# EAGLE design RTI-Dome-Shutter-ESP32 (EAGLE 9.7.0)
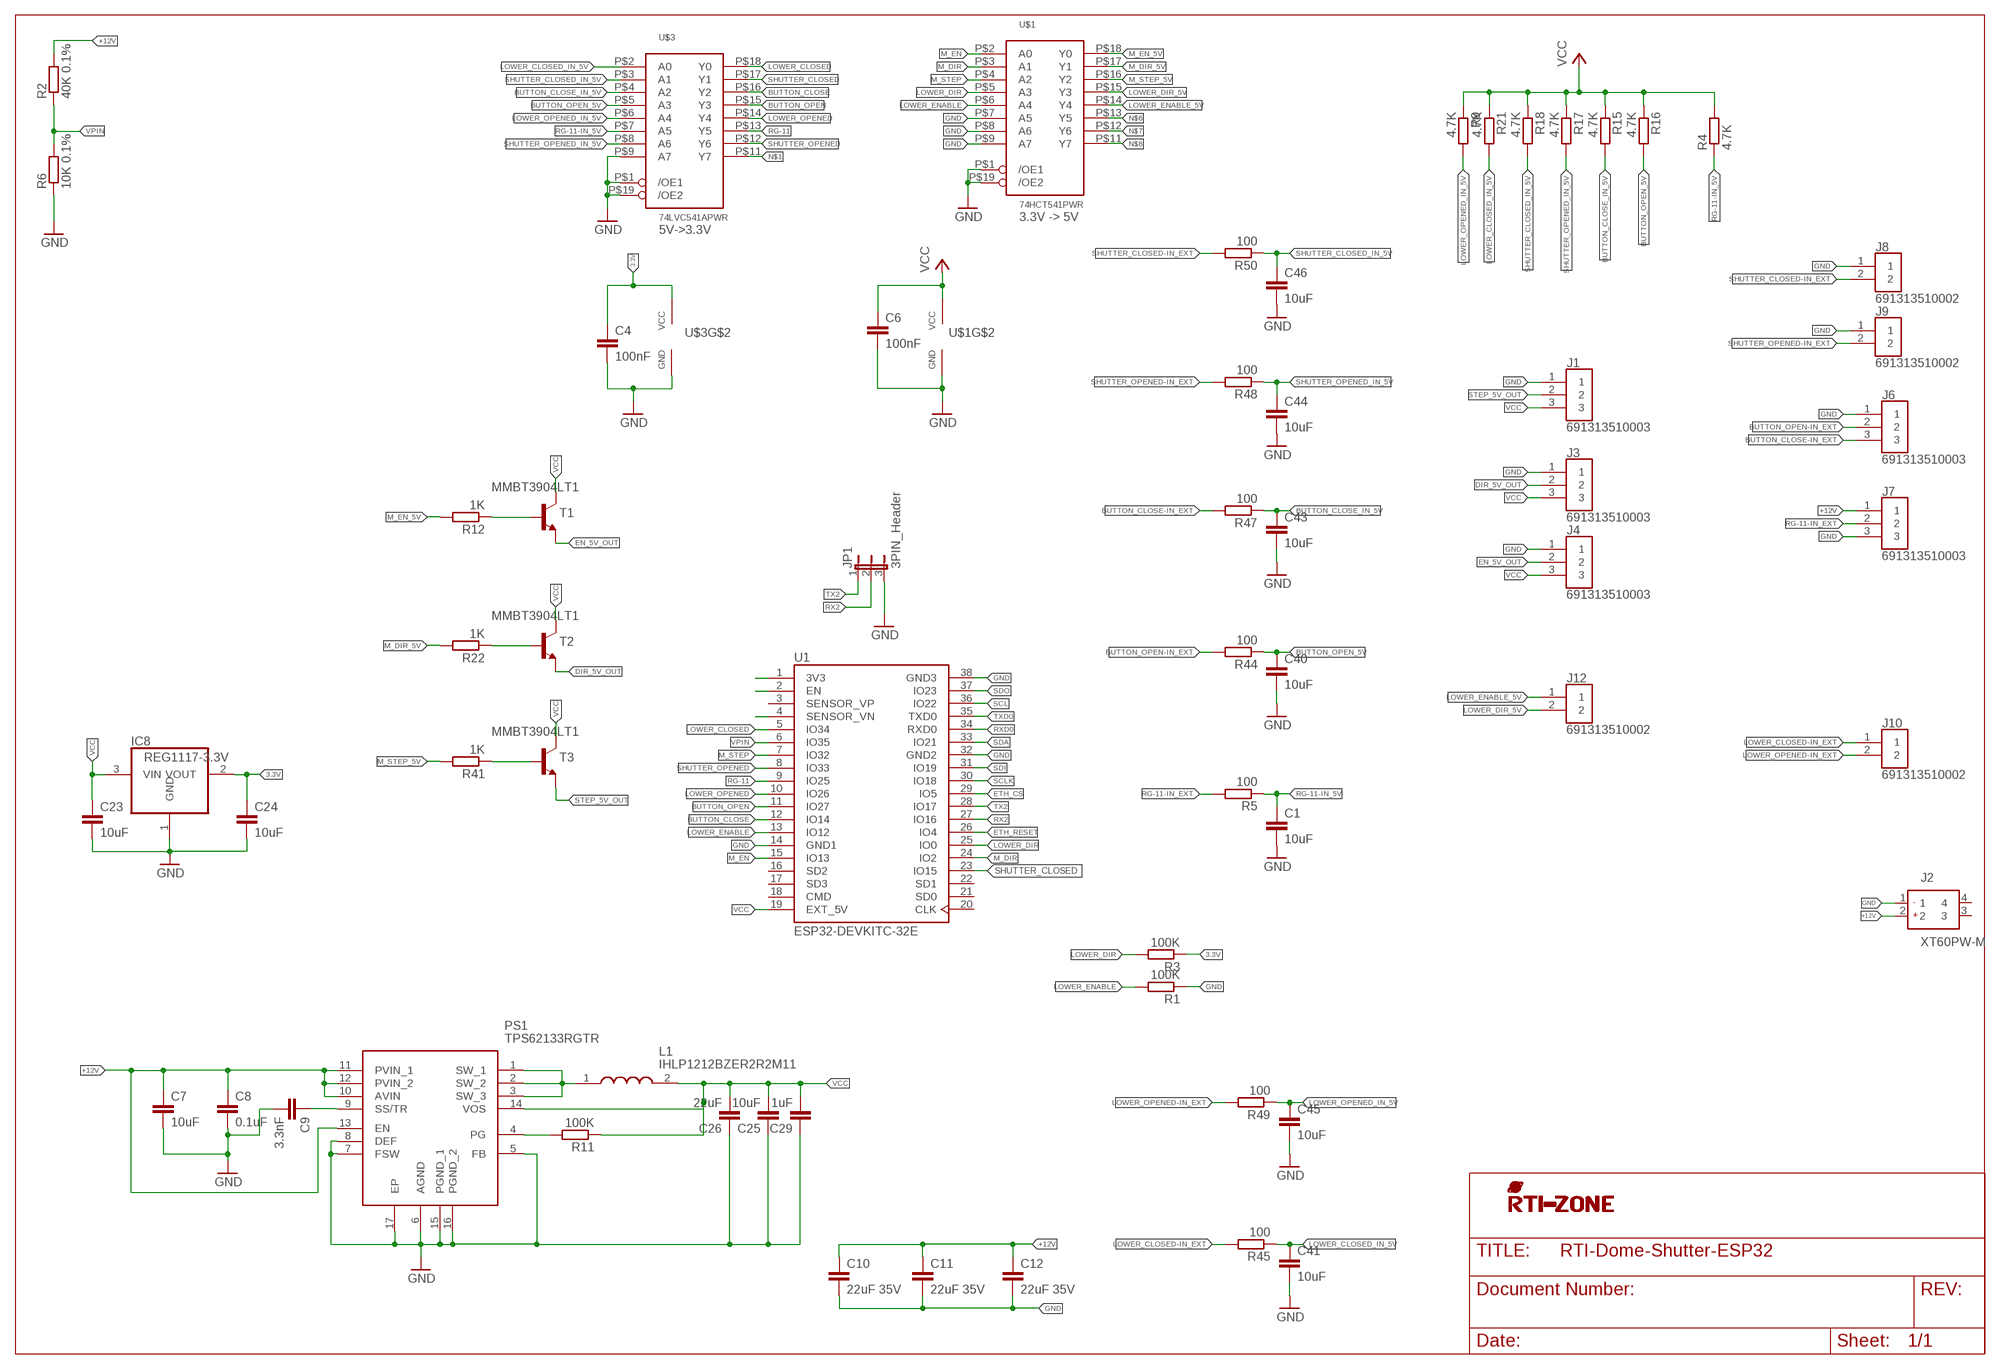
[diagram p0: schematic, sheet 1]

## Parts
C1  10uF  C-EU'0603'  [C0603]
C4  100nF  C-EU'0603'  [C0603]
C6  100nF  C-EU'0603'  [C0603]
C7  10uF  C-EUC1206  [C1206]
C8  0.1uF  C-EUC1206  [C1206]
C9  3.3nF  C-EUC0805  [C0805]
C10  22uF 35V  C-EUC1206  [C1206]
C11  22uF 35V  C-EUC1206  [C1206]
C12  22uF 35V  C-EUC1206  [C1206]
C23  10uF  C-EU'0603'  [C0603]
C24  10uF  C-EU'0603'  [C0603]
C25  10uF  C-EUC0805  [C0805]
C26  22uF  C-EUC0805  [C0805]
C29  1uF  C-EUC0805  [C0805]
C40  10uF  C-EU'0603'  [C0603]
C41  10uF  C-EU'0603'  [C0603]
C43  10uF  C-EU'0603'  [C0603]
C44  10uF  C-EU'0603'  [C0603]
C45  10uF  C-EU'0603'  [C0603]
C46  10uF  C-EU'0603'  [C0603]
IC8  REG1117-3.3V  REG1117  [SOT223]
J1  691313510003  [691313510003]
J2  XT60PW-M  [XT60PWM]
J3  691313510003  [691313510003]
J4  691313510003  [691313510003]
J6  691313510003  [691313510003]
J7  691313510003  [691313510003]
J8  691313510002  [SHDRRA2W100P0X508_1X2_1216X120]
J9  691313510002  [SHDRRA2W100P0X508_1X2_1216X120]
J10  691313510002  [SHDRRA2W100P0X508_1X2_1216X120]
J12  691313510002  [SHDRRA2W100P0X508_1X2_1216X120]
JP1  3PIN_Header  JP2E  [JP2]
L1  IHLP1212BZER2R2M11  [INDPM3630X200N]
PS1  TPS62133RGTR  [QFN50P300X300X100-17N]
R1  100K  R-EU'0603'  [R0603]
R2  40K 0.1%  R-EU'0603'  [R0603]
R3  100K  R-EU'0603'  [R0603]
R4  4.7K  R-EU'0603'  [R0603]
R5  100  R-EU'0603'  [R0603]
R6  10K 0.1%  R-EU'0603'  [R0603]
R9  4.7K  R-EU'0603'  [R0603]
R11  100K  R-EU_R0603  [R0603]
R12  1K  R-EU'0603'  [R0603]
R15  4.7K  R-EU'0603'  [R0603]
R16  4.7K  R-EU'0603'  [R0603]
R17  4.7K  R-EU'0603'  [R0603]
R18  4.7K  R-EU'0603'  [R0603]
R21  4.7K  R-EU'0603'  [R0603]
R22  1K  R-EU'0603'  [R0603]
R41  1K  R-EU'0603'  [R0603]
R44  100  R-EU'0603'  [R0603]
R45  100  R-EU'0603'  [R0603]
R47  100  R-EU'0603'  [R0603]
R48  100  R-EU'0603'  [R0603]
R49  100  R-EU'0603'  [R0603]
R50  100  R-EU'0603'  [R0603]
T1  MMBT3904LT1  MMBT3904LT1-NPN-SOT23-BEC  [SOT23-BEC]
T2  MMBT3904LT1  MMBT3904LT1-NPN-SOT23-BEC  [SOT23-BEC]
T3  MMBT3904LT1  MMBT3904LT1-NPN-SOT23-BEC  [SOT23-BEC]
U1  ESP32-DEVKITC-32E  ESP32-DEVKITC-32D  [MODULE_ESP32-DEVKITC-32D]
U$1  74HCT541PWR  74541B  [TSSOP20]
U$3  74LVC541APWR  74541B  [TSSOP20]
U$4  RTI-LOGO_BIG  [LOGO_BIG]

## Nets
3.3V: C4.1 C24.1 IC8.2(VOUT) R3.1 U$3.P$20(VCC)
+12V [+12V]: C7.1 C8.1 C10.1 C11.1 C12.1 J2.2 J7.1 PS1.10(AVIN) PS1.11(PVIN_1) PS1.12(PVIN_2) PS1.13(EN) R2.2
BUTTON_CLOSE: U1.12(IO14) U$3.P$16(Y2)
BUTTON_CLOSE-IN_EXT: J6.3 R47.2
BUTTON_CLOSE_IN_5V: C43.1 R15.2 R47.1 U$3.P$4(A2)
BUTTON_OPEN: U1.11(IO27) U$3.P$15(Y3)
BUTTON_OPEN-IN_EXT: J6.2 R44.2
BUTTON_OPEN_5V: C40.1 R16.2 R44.1 U$3.P$5(A3)
DIR-5V_TR: R22.1 T2.B
DIR_5V_OUT: J3.2 T2.E
EN-5V_TR: R12.1 T1.B
EN_5V_OUT: J4.2 T1.E
ETH_CS: U1.29(IO5)
ETH_RESET: U1.26(IO4)
GND [GND]: C1.2 C4.2 C6.2 C7.2 C8.2 C9.2 C10.2 C11.2 C12.2 C23.2 C24.2 C25.1 C26.1 C29.1 C40.2 C41.2 C43.2 C44.2 C45.2 C46.2 IC8.1(GND) J1.1 J2.1 J3.1 J4.1 J6.1 J7.3 J8.1 J9.1 JP1.3 PS1.5(FB) PS1.6(AGND) PS1.7(FSW) PS1.8(DEF) PS1.15(PGND_1) PS1.16(PGND_2) PS1.17(EP) R1.1 R6.1 U1.14(GND1) U1.32(GND2) U1.38(GND3) U$1.P$1(/OE1) U$1.P$7(A5) U$1.P$8(A6) U$1.P$9(A7) U$1.P$10(GND) U$1.P$19(/OE2) U$3.P$1(/OE1) U$3.P$9(A7) U$3.P$10(GND) U$3.P$19(/OE2)
LOWER_CLOSED: U1.5(IO34) U$3.P$18(Y0)
LOWER_CLOSED-IN_EXT: J10.1 R45.2
LOWER_CLOSED_IN_5V: C41.1 R21.2 R45.1 U$3.P$2(A0)
LOWER_DIR: R3.2 U1.25(IO0) U$1.P$5(A3)
LOWER_DIR_5V: J12.2 U$1.P$15(Y3)
LOWER_ENABLE: R1.2 U1.13(IO12) U$1.P$6(A4)
LOWER_ENABLE_5V: J12.1 U$1.P$14(Y4)
LOWER_OPENED: U1.10(IO26) U$3.P$14(Y4)
LOWER_OPENED-IN_EXT [GND]: J10.2 R49.2
LOWER_OPENED_IN_5V [GND]: C45.1 R9.2 R49.1 U$3.P$6(A4)
M_DIR: U1.24(IO2) U$1.P$3(A1)
M_DIR_5V: R22.2 U$1.P$17(Y1)
M_EN: U1.15(IO13) U$1.P$2(A0)
M_EN_5V: R12.2 U$1.P$18(Y0)
M_STEP: U1.7(IO32) U$1.P$4(A2)
M_STEP_5V: R41.2 U$1.P$16(Y2)
N$1: U$3.P$11(Y7)
N$6: U$1.P$13(Y5)
N$7: U$1.P$12(Y6)
N$8: U$1.P$11(Y7)
N$9: U1.1(3V3)
N$10: U1.2(EN)
N$11: U1.4(SENSOR_VN)
PG: PS1.4(PG) R11.2
RG-11: U1.9(IO25) U$3.P$13(Y5)
RG-11-IN_5V: C1.1 R4.1 R5.1 U$3.P$7(A5)
RG-11-IN_EXT: J7.2 R5.2
RX2: JP1.2 U1.27(IO16)
RXD0: U1.34(RXD0)
SCL: U1.36(IO22)
SCLK: U1.30(IO18)
SDA: U1.33(IO21)
SDI: U1.31(IO19)
SDO: U1.37(IO23)
SHUTTER_CLOSED: U1.23(IO15) U$3.P$17(Y1)
SHUTTER_CLOSED-IN_EXT: J8.2 R50.2
SHUTTER_CLOSED_IN_5V: C46.1 R18.2 R50.1 U$3.P$3(A1)
SHUTTER_OPENED: U1.8(IO33) U$3.P$12(Y6)
SHUTTER_OPENED-IN_EXT: J9.2 R48.2
SHUTTER_OPENED_IN_5V: C44.1 R17.2 R48.1 U$3.P$8(A6)
SS/TR: C9.1 PS1.9(SS/TR)
STEP-5V_TR: R41.1 T3.B
STEP_5V_OUT: J1.2 T3.E
SW: L1.1 PS1.1(SW_1) PS1.2(SW_2) PS1.3(SW_3)
TX2: JP1.1 U1.28(IO17)
TXD0: U1.35(TXD0)
VCC: C6.1 C23.1 C25.2 C26.2 C29.2 IC8.3(VIN) J1.3 J3.3 J4.3 L1.2 PS1.14(VOS) R4.2 R9.1 R11.1 R15.1 R16.1 R17.1 R18.1 R21.1 T1.C T2.C T3.C U1.19(EXT_5V) U$1.P$20(VCC)
VPIN: R2.1 R6.2 U1.6(IO35)
Unconnected: J2.3 J2.4 U1.3(SENSOR_VP) U1.16(SD2) U1.17(SD3) U1.18(CMD) U1.20(CLK) U1.21(SD0) U1.22(SD1)

## Notes on the sheet
- 3.3V -> 5V
- 5V->3.3V

## Library data of the parts
C1 C23 C24 C40 C41 C43-C46 = rti:C-EU; MPN: CC0805KKX5R8BB106
C4 C6 = rti:C-EU; MPN: 0805YD104KAT2A
C7-C12 C25 C26 C29 = rcl:C-EU: CAPACITOR, European symbol; SPICEPREFIX: C
IC8 = burr-brown:REG1117: 800mA and 1A Low Dropout (LDO) Positive Regulator 1.8V, 2.5V, 2.85V, 3.3V, 5V, and Adj; MPN: REG1117-3.3/2K5; OC_FARNELL: 1097566; OC_NEWARK: 14P6981
J1 J3 J4 J6 J7 = samacsys:691313510003: Wurth Elektronik 313 Series 5.08mm Pitch Straight Pluggable Terminal Block, PCB Header, Through Hole, 3 Way Source: Datasheet <https://katalog.we-online.de/em/datasheet/6913135100xx.pdf>; DESCRIPTION: Wurth Elektronik 313 Series 5.08mm Pitch Straight Pluggable Terminal Block, PCB Header, Through Hole, 3 Way; HEIGHT: 8.7mm; MANUFACTURER_NAME: Wurth Elektronik; MANUFACTURER_PART_NUMBER: 691313510003; MOUSER_PART_NUMBER: 710-691313510003; MOUSER_PRICE-STOCK: https://www.mouser.co.uk/ProductDetail/Wurth-Elektronik/691313510003?qs=E2PpAYvlWVuriHHnVOgTEg%3D%3D
J2 = samacsys:XT60PW-M: Socket; DC supply; XT60; male; PIN: 2; on PCBs; THT; Colour: yellow Source: Datasheet <https://www.tme.eu/Document/9b8d0c5eb7094295f3d3112c214d3ade/XT60PW SPEC.pdf>; DESCRIPTION: Socket; DC supply; XT60; male; PIN: 2; on PCBs; THT; Colour: yellow; HEIGHT: 8.4mm; LCSC_PART: C98732; MANUFACTURER_NAME: Changzou Amass Elec; MANUFACTURER_PART_NUMBER: XT60PW-M; MPN: XT60PW-M
J8-J10 J12 = samacsys:691313510002: 2 Position Terminal Block Header, Male Pins, Shrouded (4 Side) 0.200" (5.08mm) 90, Right Angle Through Hole Source: Datasheet <https://www.we-online.de/katalog/datasheet/6913135100xx.pdf>; DESCRIPTION: 2 Position Terminal Block Header, Male Pins, Shrouded (4 Side) 0.200" (5.08mm) 90, Right Angle Through Hole; HEIGHT: 8.5mm; MANUFACTURER_NAME: Wurth Elektronik; MANUFACTURER_PART_NUMBER: 691313510002; MOUSER_PART_NUMBER: 710-691313510002; MOUSER_PRICE-STOCK: https://www.mouser.co.uk/ProductDetail/Wurth-Elektronik/691313510002?qs=2kOmHSv6VfR6BrMDgUh3kQ%3D%3D
JP1 = rti:JP2E: JUMPER; LCSC_PART: C19190477
L1 = samacsys:IHLP1212BZER2R2M11: Vishay IHLP1212BZ-11 Series Shielded Wire-wound SMD Inductor with a Metal Composite Core, 2.2 uH +/-20% Wire-Wound 3A Idc Source: Datasheet <https://www.vishay.com/docs/34289/lp12bz11.pdf>; ARROW_PART_NUMBER: IHLP1212BZER2R2M11; ARROW_PRICE-STOCK: https://www.arrow.com/en/products/ihlp1212bzer2r2m11/vishay?region=nac; DESCRIPTION: Vishay IHLP1212BZ-11 Series Shielded Wire-wound SMD Inductor with a Metal Composite Core, 2.2 uH +/-20% Wire-Wound 3A Idc; HEIGHT: 2mm; LCSC_PART: C553996; MANUFACTURER_NAME: Vishay; MANUFACTURER_PART_NUMBER: IHLP1212BZER2R2M11; MOUSER_PART_NUMBER: 70-IHLP1212BZER2R2M1; MOUSER_PRICE-STOCK: https://www.mouser.co.uk/ProductDetail/Vishay-Dale/IHLP1212BZER2R2M11?qs=OXt1GPNndFc1xOXvysj2ew%3D%3D
PS1 = samacsys:TPS62133RGTR: 3-17V 3A Step-Down Converter in 3x3 QFN Package Source: Datasheet <http://www.ti.com/lit/gpn/tps62133>; ARROW_PART_NUMBER: TPS62133RGTR; ARROW_PRICE-STOCK: https://www.arrow.com/en/products/tps62133rgtr/texas-instruments?region=nac; DESCRIPTION: 3-17V 3A Step-Down Converter in 3x3 QFN Package; HEIGHT: 1mm; LCSC_PART: C73973; MANUFACTURER_NAME: Texas Instruments; MANUFACTURER_PART_NUMBER: TPS62133RGTR; MOUSER_PART_NUMBER: 595-TPS62133RGTR; MOUSER_PRICE-STOCK: https://www.mouser.co.uk/ProductDetail/Texas-Instruments/TPS62133RGTR?qs=gXEV9p%2FxLgfynMj9v6Z0Jw%3D%3D
R1 R3 R5 R44 R45 R47-R50 = rti:R-EU; MPN: RT0805FRD07100RL
R2 R6 = rti:R-EU; MPN: AT0805BRD07100KL
R4 R9 R12 R15-R18 R21 R22 R41 = rti:R-EU; MPN: RT0805FRE074K7L
R11 = rcl:R-EU_: RESISTOR, European symbol; SPICEPREFIX: R
T1-T3 = transistor:*-NPN-: NPN Transistror BF959 corrected 2008.03.06
U1 = ESP32-DEVKITC-32D:ESP32-DEVKITC-32: Check availability <https://pricing.snapeda.com/parts/ESP32-DEVKITC-32D/Espressif%20Systems/view-part?ref=eda>; AVAILABILITY: In Stock; CHECK_PRICES: https://www.snapeda.com/parts/ESP32-DEVKITC-32D/Espressif+Systems/view-part/?ref=eda; DESCRIPTION: WiFi Development Tools (802.11) ESP32 General Development Kit, ESP32-WROOM-32D on the board; MF: Espressif Systems; MP: ESP32-DEVKITC-32D; PACKAGE: None; PRICE: None; SNAPEDA_LINK: https://www.snapeda.com/parts/ESP32-DEVKITC-32D/Espressif+Systems/view-part/?ref=snap
U$1 U$3 = rti:74*541: Octal non inverting buffer
U$4 = rti:RTI-LOGO

## Net classes
0 default: width 0.254 mm, drill 0.3 mm, clearance 0.152 mm
1 +12V: width 0.254 mm, drill 0.3 mm, clearance 0.152 mm
2 GND: width 0.254 mm, drill 0.3 mm, clearance 0.152 mm
3 +3V3: width 0.254 mm, drill 0.254 mm, clearance 0.152 mm
4 diff: width 0.254 mm, drill 0.254 mm, clearance 0.152 mm

## Board
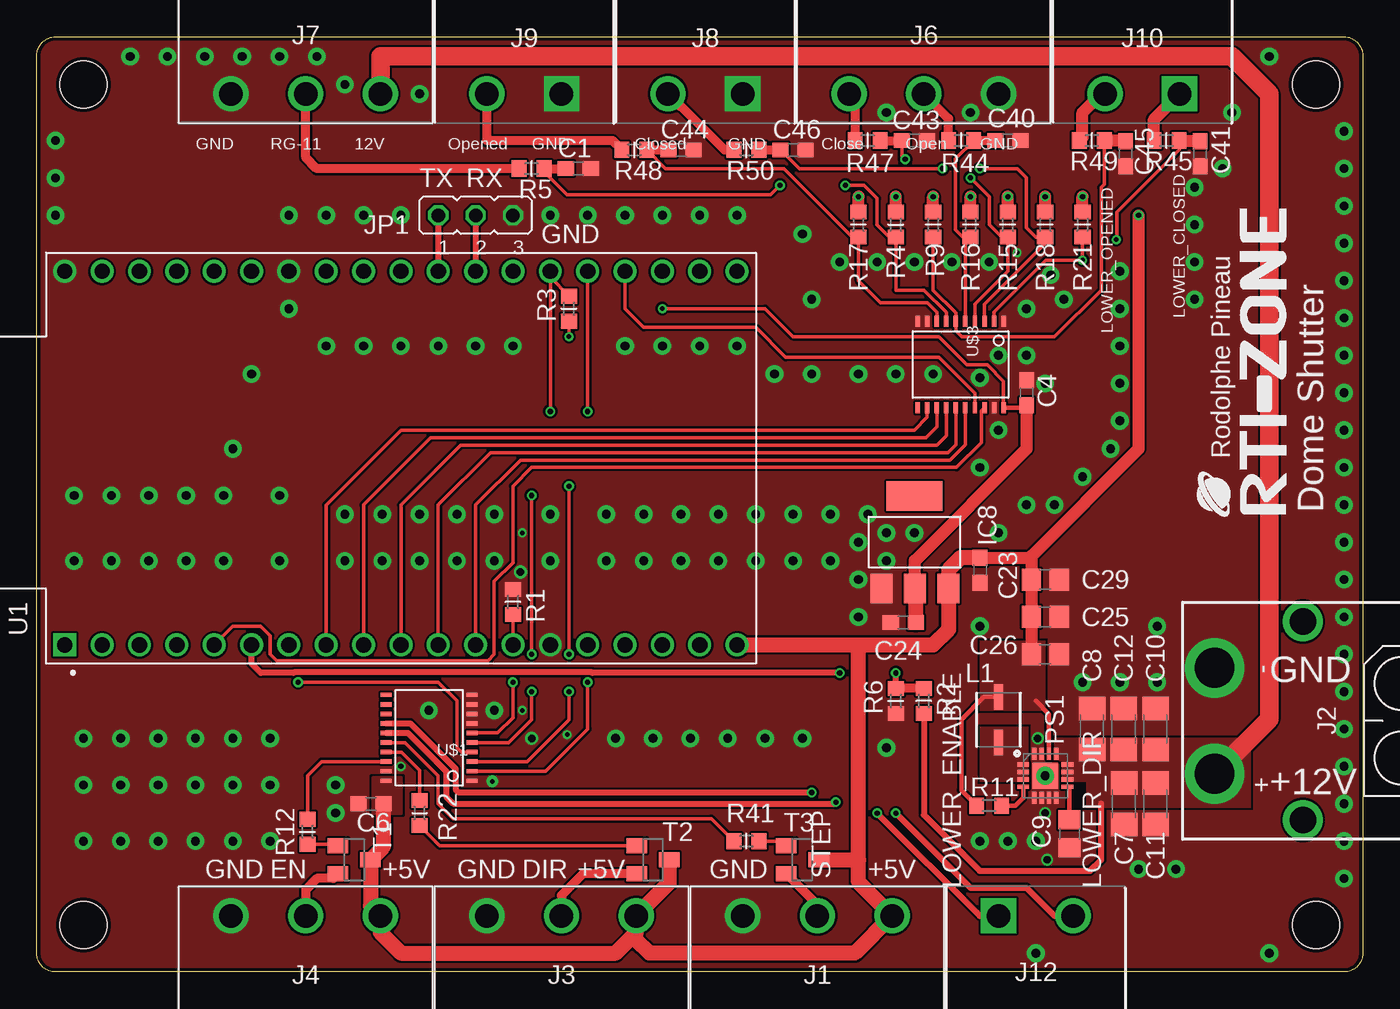
[diagram p1: board, top side]
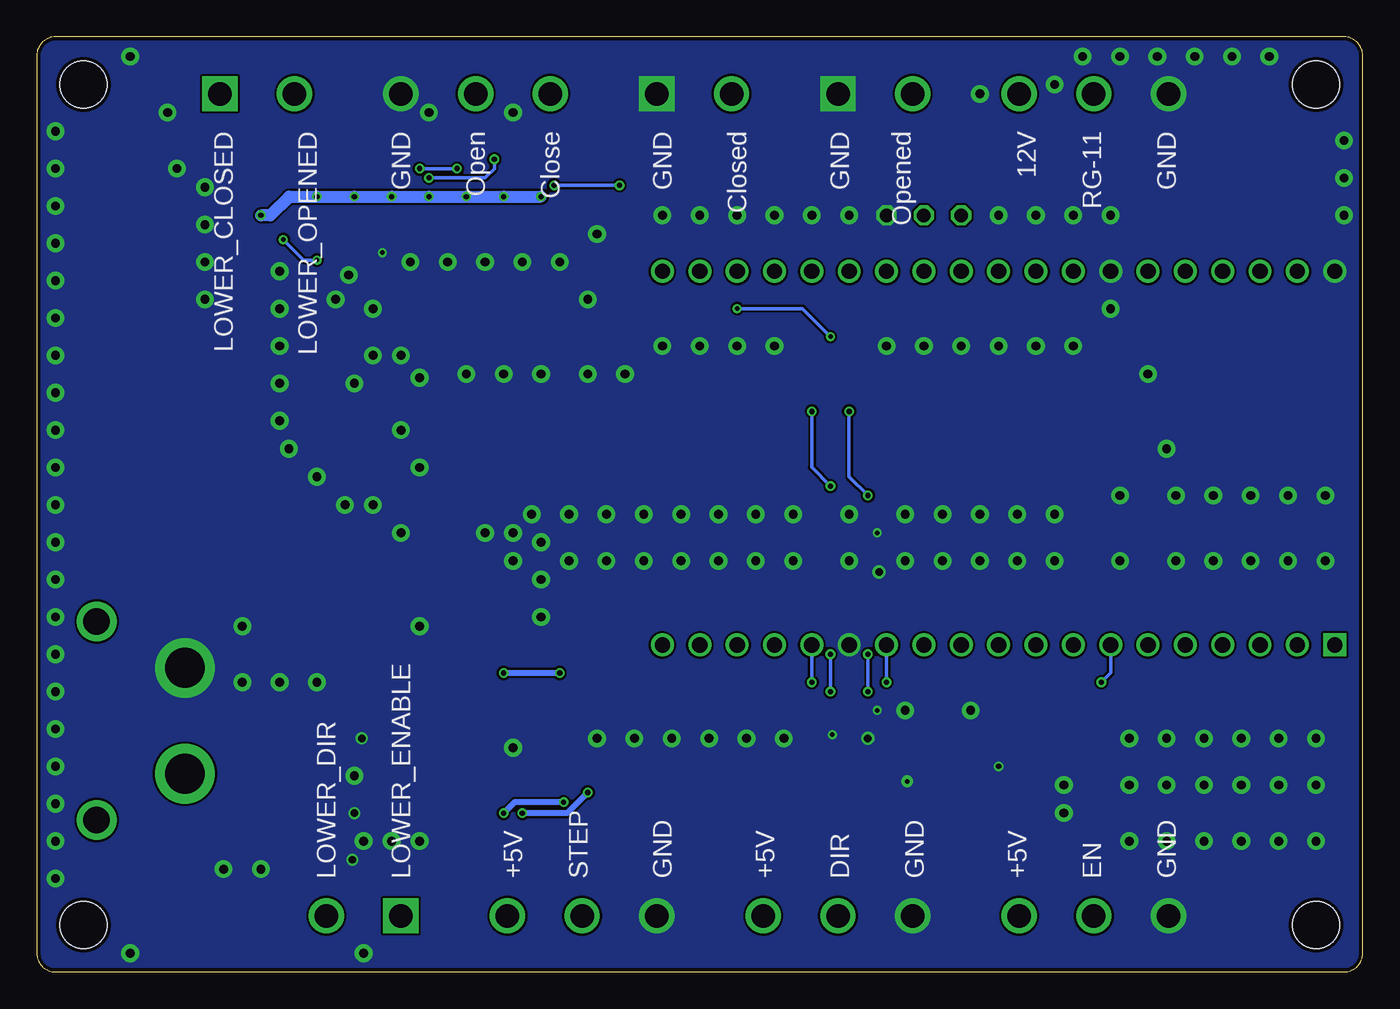
[diagram p2: board, bottom side, seen from below]

Size 90.17 x 63.57 mm. Coordinates in mm from the lower left corner, seen from the top.
Outline: 0,62.31 arc-90 1.26,63.57 88.92,63.57 arc-90 90.17,62.31 90.17,1.26 arc-90 88.92,0 1.26,0 arc-90 0,1.26 0,62.31
Copper layers (1*16): Top 0.089mm / dielectric 1.442mm / Bottom 0.089mm
Design rules "jlcpcb2layer *": minimum track width 5mil, minimum drill 0.2mm, track to track 5mil, track to pad 5mil, pad to pad 5mil, via to via 5mil, smd to smd 5mil, copper to edge 10mil, drill to drill 0.5mm, minimum pad ring 6mil, minimum via ring 6mil, stop-mask expansion 0.05mm, vias tented up to drill 130mil, thermal gap 8mil
Holes 3.2 mm at 87,60.33 87,3.17 3.17,3.17 3.17,60.33

### Footprints (pad centres in the part's own frame; a part is rotated, then mirrored left to right if it is on the bottom)
C0603 = smd 1.1 x 1: 1 -0.85,0; 2 0.85,0
C1206 = smd 1.6 x 1.8: 1 -1.4,0; 2 1.4,0
C0805 = smd 1.3 x 1.5: 1 -0.95,0; 2 0.95,0
SOT223 = smd 2.007 x 1.499: 1 3.15,-2.261; 2 3.15,0.025; 3 3.15,2.311 | smd 2.007 x 3.81: 4 -3.15,0
691313510003 = drill 1.6 pad 2.4: 1 -5.08,0; 2 0,0; 3 5.08,0
XT60PWM = drill 2.7 pad 4.05: 1 -3.6,0; 2 3.6,0 | drill 1.8 pad 2.7: 3 6.75,6; 4 -6.75,6
SHDRRA2W100P0X508_1X2_1216X120 = drill 1.6 pad 2.4 square: 1 -2.54,0 | drill 1.6 pad 2.4: 2 2.54,0
JP2 = drill 0.914 octagon: 1 -2.54,0; 2 0,0; 3 2.54,0
INDPM3630X200N = smd 1.75 x 0.6: 1 -1.55,0; 2 1.55,0
QFN50P300X300X100-17N = smd 0.8 x 0.3: 1 -1.5,0.75; 2 -1.5,0.25; 3 -1.5,-0.25; 4 -1.5,-0.75; 9 1.5,-0.75; 10 1.5,-0.25; 11 1.5,0.25; 12 1.5,0.75 | smd 0.3 x 0.8: 5 -0.75,-1.5; 6 -0.25,-1.5; 7 0.25,-1.5; 8 0.75,-1.5; 13 0.75,1.5; 14 0.25,1.5; 15 -0.25,1.5; 16 -0.75,1.5 | smd 1.75 x 1.75: 17 0,0
R0603 = smd 1 x 1.1: 1 -0.85,0; 2 0.85,0
SOT23-BEC = smd 1 x 1.4: B -0.95,-1.1; C 0,1.1; E 0.95,-1.1
MODULE_ESP32-DEVKITC-32D = drill 1.04 square: 1 -12.7,20.32 | drill 1.04: 2 -12.7,17.78; 3 -12.7,15.24; 4 -12.7,12.7; 5 -12.7,10.16; 6 -12.7,7.62; 7 -12.7,5.08; 8 -12.7,2.54; 9 -12.7,0; 10 -12.7,-2.54; 11 -12.7,-5.08; 12 -12.7,-7.62; 13 -12.7,-10.16; 14 -12.7,-12.7; 15 -12.7,-15.24; 16 -12.7,-17.78; 17 -12.7,-20.32; 18 -12.7,-22.86; 19 -12.7,-25.4; 20 12.7,-25.4; 21 12.7,-22.86; 22 12.7,-20.32; 23 12.7,-17.78; 24 12.7,-15.24; 25 12.7,-12.7; 26 12.7,-10.16; 27 12.7,-7.62; 28 12.7,-5.08; 29 12.7,-2.54; 30 12.7,0; 31 12.7,2.54; 32 12.7,5.08; 33 12.7,7.62; 34 12.7,10.16; 35 12.7,12.7; 36 12.7,15.24; 37 12.7,17.78; 38 12.7,20.32
TSSOP20 = smd 0.3 x 0.75: P$1 -2.885,-2.94; P$2 -2.235,-2.94; P$3 -1.585,-2.94; P$4 -0.935,-2.94; P$5 -0.285,-2.94; P$6 0.365,-2.94; P$7 1.015,-2.94; P$8 1.665,-2.94; P$9 2.315,-2.94; P$10 2.965,-2.94; P$11 2.965,2.91; P$12 2.315,2.91; P$13 1.665,2.91; P$14 1.015,2.91; P$15 0.365,2.91; P$16 -0.285,2.91; P$17 -0.935,2.91; P$18 -1.585,2.91; P$19 -2.235,2.91; P$20 -2.885,2.91

### Placement (x,y rotation side)
C1  36.83,54.61 0 top
C4  67.31,39.37 90 top
C6  22.73,11.43 180 top
C7  73.94,11.43 270 top
C8  71.75,16.51 90 top
C9  70.23,9.4 270 top
C10  76.07,16.51 90 top
C11  76.07,11.43 270 top
C12  73.91,16.51 90 top
C23  64.14,27.3 270 top
C24  58.93,23.75 180 top
C25  68.58,24.13 180 top
C26  68.58,21.59 180 top
C29  68.58,26.67 180 top
C40  66.04,56.52 0 top
C41  79.12,55.63 270 top
C43  59.69,56.52 0 top
C44  43.81,55.88 0 top
C45  74.04,55.63 270 top
C46  51.44,55.88 0 top
IC8  59.69,29.21 270 top
J1  53.09,3.81 0 top
J2  80.1,17.07 270 top
J3  35.69,3.81 0 top
J4  18.29,3.81 0 top
J6  60.33,59.69 180 top
J7  18.29,59.69 180 top
J8  45.47,59.69 180 top
J9  33.15,59.69 180 top
J10  75.18,59.69 180 top
J12  67.94,3.81 0 top
JP1  29.84,51.44 0 top
L1  65.41,17.14 90 top
PS1  68.58,13.34 0 top
R1  32.38,25.15 270 top
R2  60.33,18.41 270 top
R3  36.2,45.09 90 top
R4  58.42,50.8 90 top
R5  33.66,54.61 180 top
R6  58.42,18.41 90 top
R9  60.96,50.8 270 top
R11  64.77,11.3 0 top
R12  18.41,9.53 90 top
R15  66.04,50.8 270 top
R16  63.5,50.8 270 top
R17  55.88,50.8 270 top
R18  68.58,50.8 270 top
R21  71.12,50.8 270 top
R22  26.04,10.79 90 top
R41  48.26,8.89 180 top
R44  62.87,56.52 180 top
R45  76.83,56.52 180 top
R47  56.52,56.52 180 top
R48  40.64,55.88 180 top
R49  71.75,56.52 180 top
R50  48.26,55.88 180 top
T1  21.59,7.62 270 top
T2  41.91,7.62 270 top
T3  52.07,7.62 270 top
U1  22.23,34.92 90 top
U$1  26.67,15.88 90 top
U$3  62.87,41.27 180 top
U$4  84.96,31.11 90 top

### Tracks (layer width: path | path; a pad name or v marks a point on that pad's centre or on a via)
3.3V  (via drill 0.3)
  Top 0.254: C4.1 67.16,38.37 | R3.1 v36.2,43.18 | v42.55,45.09 49.53,45.09 51.44,43.18 61.34,43.18 63.25,41.27 64.64,41.27 65.75,40.17 U$3.P$20
  Top 0.305: U$3.P$20 67.16,38.37
  Top 0.813: IC8.2 59.72,27.96 67.31,35.56 C4.1
  Top 1.016: IC8.2 59.74,26.04 C24.1
  Bottom 0.254: v36.2,43.18 38.1,45.09 v42.55,45.09
+12V
  Top 0.406: R2.2 60.33,10.67 64.14,6.86 71.63,6.86 72.39,7.62 72.39,11.43
  Top 1.27: J7.1 23.37,62.23 81.28,62.23 83.82,59.69 83.82,17.19 J2.2
  pour Top (no thermals): 71.38,12.96 71.38,12.96 71.38,11.18 82.55,11.18 82.55,15.87 69.22,15.87 69.22,14.35 69.72,14.35 69.73,14.35 69.73,12.96
BUTTON_CLOSE
  Top 0.254: U$3.P$16 63.15,35.84 62.1,34.8 32.89,34.8 29.84,31.75 U1.12
BUTTON_CLOSE-IN_EXT
  Top 0.61: R47.2 55.66,59.27 J6.3
BUTTON_CLOSE_IN_5V  (via drill 0.35)
  Top 0.254: U$3.P$4 63.8,45.38 66.04,47.62 R15.2 65.62,49.95 64.77,50.8 64.77,52.7 v63.5,53.98 | v59.05,55.24 58.84,55.46 C43.1
  Top 0.61: R47.1 C43.1
  Bottom 0.254: v63.5,53.98 59.69,53.98 59.05,54.61 v59.05,55.24
BUTTON_OPEN
  Top 0.254: U$3.P$15 62.5,35.83 61.98,35.31 30.86,35.31 27.3,31.75 U1.11
BUTTON_OPEN-IN_EXT
  Top 0.61: R44.2 62.02,58 J6.2
BUTTON_OPEN_5V
  Top 0.254: U$3.P$5 63.15,49.6 R16.2 62.99,49.95 62.48,50.46 62.48,55.28 R44.1
  Top 0.61: C40.1 R44.1
DIR-5V_TR
  Top 0.254: T2.B 27.41,8.57 R22.1
DIR_5V_OUT
  Top 0.61: T2.E 37.15,6.67 35.69,5.21 J3.2
EN-5V_TR
  Top 0.254: R12.1 20.39,8.68 T1.B
EN_5V_OUT
  Top 0.61: T1.E 20.17,6.35 19.05,6.35 18.29,5.59 J4.2
GND  (via drill 0.3, 0.3 pad 0.6, 0.3 pad 0.8, 0.35, 0.5 pad 0.3, 0.5 pad 0.9, 0.6 pad 1.2)
  other vias: 14.61,40.64 17.14,45.09 67.31,31.75 57.78,15.24 40.01,51.44 42.55,51.44 76.2,23.5 68.58,40.01 65.41,36.83 13.34,35.56 20.32,12.7 20.32,10.79 69.85,45.72 20.95,27.94 23.5,27.94 26.04,27.94 28.57,27.94 31.11,27.94 31.11,31.11 28.57,31.11 26.04,31.11 23.5,31.11 20.95,31.11 34.92,31.11 34.92,27.94 26.67,17.78 24.77,13.97 30.99,12.95 31.11,17.78 88.9,54.61 88.9,52.07 88.9,57.15 88.9,49.53 88.9,46.99 88.9,44.45 88.9,41.91 88.9,39.37 88.9,34.29 88.9,31.75 88.9,29.21 88.9,26.67 88.9,24.13 88.9,36.83 12.7,32.38 10.16,32.38 7.62,32.38 5.08,32.38 2.54,32.38 16.51,32.38 12.7,27.94 10.16,27.94 7.62,27.94 5.08,27.94 2.54,27.94 16.51,27.94 13.34,15.88 10.79,15.88 8.26,15.88 5.71,15.88 3.17,15.88 15.88,15.88 49.53,15.88 46.99,15.88 44.45,15.88 41.91,15.88 39.37,15.88 52.07,15.88 68.58,13.34 67.94,1.27 34.92,51.44 17.14,51.44 19.68,51.44 22.23,51.44 24.77,51.44 37.47,51.44 29.84,42.55 27.3,42.55 24.77,42.55 22.23,42.55 19.68,42.55 32.38,42.55 58.42,40.64 47.62,42.55 45.09,42.55 42.55,42.55 40.01,42.55 65.41,41.91 51.44,31.11 46.35,31.11 43.81,31.11 41.27,31.11 38.73,31.11 53.98,31.11 48.9,27.94 46.35,27.94 43.81,27.94 41.27,27.94 38.73,27.94 51.44,27.94 13.34,12.7 10.79,12.7 8.26,12.7 5.71,12.7 3.17,12.7 15.88,12.7 13.34,8.89 10.79,8.89 8.26,8.89 5.71,8.89 3.17,8.89 15.88,8.89 16.51,62.23 13.97,62.23 11.43,62.23 8.89,62.23 6.35,62.23 19.05,62.23 1.27,56.52 1.27,53.98 80.64,54.61 78.74,53.34 78.74,50.8 78.74,48.26 78.74,45.72 81.28,58.42 20.95,60.33 83.82,62.23 1.27,51.44 26.04,59.69 33.66,15.88 36.07,16.13 33.02,17.78 32.89,27.18 33.02,29.84 67.31,45.09 52.7,45.72 74.93,6.99 77.47,6.99 76.2,19.68 73.66,19.68 71.12,19.68 88.9,21.59 88.9,19.05 88.9,16.51 88.9,13.97 88.9,11.43 88.9,8.89 88.9,6.35 83.82,1.27 64.14,23.5 55.88,26.67 68.58,10.79 68.71,7.62 68.07,15.88 64.77,48.26 68.96,47.37 63.5,58.42 57.78,58.42 52.07,50.16 62.23,48.26 59.69,48.26 57.15,48.26 54.61,48.26 47.62,51.44 45.09,51.44 66.67,48.9 67.94,8.89 66.04,8.89 64.14,8.89 55.88,40.64 52.7,40.64 50.16,40.64 60.96,40.64 73.66,47.62 73.66,45.09 73.66,42.55 73.66,40.01 73.66,37.47 73.03,35.56 71.12,33.66 69.22,31.75 64.14,34.29 65.41,29.84 55.88,24.13 55.88,29.21 56.52,31.11 57.78,29.84 57.78,27.94 59.69,29.84 53.98,27.94 48.9,31.11 67.31,41.91 64.14,40.39
  pour Bottom (isolate 0.122, rank 2, no thermals): 0.15,0.15 90.02,0.15 90.02,63.35 0.15,63.35
  pour Top (isolate 0.122, rank 2, no thermals): 0.13,0.13 90.04,0.13 90.04,63.37 0.13,63.37
LOWER_CLOSED
  Top 0.254: U$3.P$18 64.23,38.14 64.23,35.97 62.55,34.29 33.66,34.29 32.38,33.02 32.38,27.81 31.11,26.54 31.11,21.59 30.69,21.17 17.78,21.17 17.57,21.17 16.3,21.17 15.88,21.59 15.88,22.86 15.24,23.5 13.34,23.5 U1.5
LOWER_CLOSED-IN_EXT
  Top 0.813: R45.2 75.98,57.95 J10.1
LOWER_CLOSED_IN_5V  (via drill 0.3)
  Top 0.254: R45.1 77.69,55.88 73.45,51.65 73.45,49.78 v73.41,49.78 | 65.1,44.65 U$3.P$2 65.1,44.85 68.64,48.39 v71.12,48.39 R21.2
  Top 0.813: R45.1 79.08,56.52 C41.1
  Bottom 0.254: v73.41,49.78 72.01,48.39 v71.12,48.39
LOWER_DIR  (via drill 0.35)
  Top 0.254: v34.92,38.1 U1.25 34.92,47.2 R3.2 | v33.66,32.38 v33.66,21.59 | v33.66,19.05 33.66,17.14 32.1,15.59 U$1.P$5
  Bottom 0.254: v34.92,38.1 34.92,33.66 v33.66,32.38 | v33.66,21.59 v33.66,19.05
LOWER_DIR_5V  (via drill 0.35)
  Top 0.254: 54.23,11.43 v54.34,11.54
  Top 0.406: U$1.P$15 25.23,16.24 27.84,13.63 27.84,11.91 28.32,11.43 54.23,11.43 | v58.42,10.79 63.5,5.71 67.31,5.71 69.22,3.81 J12.2
  Bottom 0.406: v54.34,11.54 57.67,11.54 v58.42,10.79
LOWER_ENABLE  (via drill 0.35)
  Top 0.254: v32.38,19.68 32.38,17.27 31.35,16.24 U$1.P$6 | R1.2 U1.13
  Bottom 0.254: U1.13 v32.38,19.68
LOWER_ENABLE_5V  (via drill 0.35)
  Top 0.406: U$1.P$14 25.4,16.89 28.5,13.79 28.5,12.39 28.7,12.19 v52.7,12.19 | J12.1 64.14,3.81 v57.15,10.79
  Bottom 0.406: v52.7,12.19 54.1,10.79 v57.15,10.79
LOWER_OPENED
  Top 0.254: U$3.P$14 61.85,36.45 61.21,35.81 28.83,35.81 24.77,31.75 U1.10
LOWER_OPENED-IN_EXT
  Top 0.813: R49.2 71.12,56.73 71.12,58.42 72.39,59.69 J10.2
LOWER_OPENED_IN_5V
  Top 0.254: R9.2 60.96,46.35 62.5,44.81 U$3.P$6 62.5,43.58 62.9,43.18 69.22,43.18 72.39,46.35 72.39,53.34 72.61,53.55 R49.1
  Top 0.813: C45.1 74,56.52 R49.1
M_DIR  (via drill 0.35)
  Top 0.254: U1.24 v37.47,38.1 | v36.2,33.02 v36.2,21.59 | v36.2,19.05 36.2,17.14 33.34,14.29 U$1.P$3
  Bottom 0.254: v37.47,38.1 37.47,34.29 v36.2,33.02 | v36.2,21.59 v36.2,19.05
M_DIR_5V
  Top 0.254: U$1.P$17 24.81,14.94 26.04,13.72 R22.2
M_EN  (via drill 0.35)
  Top 0.254: U$1.P$2 34.59,13.64 37.47,16.51 v37.47,19.68
  Bottom 0.254: v37.47,19.68 U1.15
M_EN_5V
  Top 0.254: U$1.P$18 19.37,14.29 18.41,13.34 R12.2
M_STEP  (via drill 0.35)
  Top 0.254: U$1.P$4 28.88,14.94 28.57,15.24 28.57,18.41 27.3,19.68 v17.78,19.68
  Bottom 0.254: v17.78,19.68 17.14,20.32 U1.7
M_STEP_5V
  Top 0.254: R41.2 45.89,10.41 28.32,10.41 27.3,11.43 27.3,13.34 25.05,15.59 U$1.P$16
PG
  Top 0.3: PS1.4 67.08,11.84 66.55,11.3 R11.2
RG-11
  Top 0.254: U$3.P$13 61.2,37.07 60.45,36.32 26.8,36.32 22.23,31.75 U1.9
RG-11-IN_5V  (via drill 0.35)
  Top 0.254: v54.99,53.47 56.26,53.47 57.15,52.58 57.15,50.8 58,49.95 R4.1 58.42,46.35 60.33,46.35 61.85,44.83 U$3.P$7 | v50.55,53.47 49.91,52.83 36.07,52.83 34.51,54.4 R5.1
  Top 0.61: R5.1 C1.1
  Bottom 0.254: v54.99,53.47 v50.55,53.47
RG-11-IN_EXT
  Top 0.61: R5.2 19.05,54.61 18.29,55.37 J7.2
RX2
  Top 0.406: JP1.2 U1.27
SHUTTER_CLOSED
  Top 0.254: U$3.P$17 63.8,39.32 61.34,41.78 50.93,41.78 48.9,43.81 41.27,43.81 40.01,45.09 U1.23
SHUTTER_CLOSED-IN_EXT
  Top 0.61: R50.2 46.77,55.88 43.81,58.84 43.78,58.84 J8.2
SHUTTER_CLOSED_IN_5V  (via drill 0.35)
  Top 0.254: U$3.P$3 64.45,45.4 68.58,49.53 R18.2 67.94,49.95 67.31,50.59 67.31,53.98 66.67,54.61 v64.14,54.61 | v61.59,54.61 51.85,54.61 C46.1
  Top 0.61: R50.1 C46.1
  Bottom 0.254: v64.14,54.61 v61.59,54.61
SHUTTER_OPENED
  Top 0.254: U$3.P$12 60.55,37.69 59.69,36.83 24.77,36.83 19.67,31.73 19.67,22.24 U1.8
SHUTTER_OPENED-IN_EXT
  Top 0.61: R48.2 39.16,56.52 30.61,56.52 J9.2
SHUTTER_OPENED_IN_5V
  Top 0.254: U$3.P$8 61.2,44.84 60.55,45.49 57.38,45.49 55.88,46.99 R17.2 55.46,49.95 50.8,54.61 42.76,54.61 R48.1
  Top 0.61: R48.1 C44.1
SS/TR
  Top 0.3: PS1.9 70.23,12.43 C9.1
STEP-5V_TR
  Top 0.254: R41.1 50.65,8.89 T3.B
STEP_5V_OUT
  Top 0.61: T3.E 53.09,4.55 J1.2
SW
  pour Top (no thermals): 64.14,12.96 67.43,12.96 67.43,16.63 64.14,16.63
TX2
  Top 0.406: JP1.1 U1.28
VCC  (via drill 0.35)
  Top 0.3: PS1.14 68.83,17.53 67.94,18.41 | L1.2 64.42,18.7 62.87,17.14 62.87,12.36 R11.1
  Top 0.813: R17.1 v55.88,52.7 | R4.2 v58.42,52.7 | R9.1 v60.96,52.7 | R16.1 v63.5,52.7 | R15.1 v66.04,52.7 | R18.1 v68.58,52.7 | R21.1 v71.12,52.7 | C23.1 67.63,28.16 | 67.63,28.16 67.63,28.25 74.93,35.55 v74.93,51.44 | 67.63,28.16 C29.2 C25.2 C26.2
  Top 1.016: C23.1 62.83,28.16 62,27.33 IC8.3 62,23.27 60.96,22.23 55.88,22.23 | T3.C 55.88,7.62 | 55.88,7.62 55.88,22.23 | U1.19 55.88,22.23 | C6.1 23.58,8.51 T1.C 22.69,4.49 J4.3 23.37,2.67 24.77,1.27 39.37,1.27 40.77,2.67 J3.3 | 55.88,7.62 55.88,6.1 J1.3 55.63,1.27 41.66,1.27 40.77,2.16 J3.3 | T2.C 43.01,6.05 J3.3
  Bottom 0.813: v74.93,51.44 74.3,51.44 73.03,52.7 v71.12,52.7 v68.58,52.7 v66.04,52.7 v63.5,52.7 v60.96,52.7 v58.42,52.7 v55.88,52.7
  pour Top (no thermals): 22.86,10.79 24.77,10.79 24.77,13.19 22.86,13.19
  pour Top (no thermals): 64.14,17.78 68.58,17.78 68.58,22.48 64.14,22.48
VPIN  (via drill 0.35)
  Top 0.406: R6.2 v58.42,20.32 | v54.61,20.32 37.8,20.32 37.75,20.37 17.5,20.37 17.45,20.32 15.24,20.32 14.61,20.95 U1.6
  Top 0.61: R2.1 R6.2
  Bottom 0.406: v58.42,20.32 v54.61,20.32

### Text on the board
tPlace: GND | RG-11 | 12V | Opened | GND | Closed | GND | Close | Open | GND | TX | RX | LOWER_OPENED | GND | LOWER_CLOSED | Dome Shutter | GND | +12V | +5V | GND | EN | +5V | GND | DIR | GND | STEP | +5V | LOWER_ENABLE | LOWER_DIR
bPlace: GND | RG-11 | 12V | Opened | GND | Closed | GND | Close | Open | GND | LOWER_OPENED | LOWER_CLOSED | GND | EN | +5V | GND | DIR | +5V | GND | STEP | +5V | LOWER_ENABLE | LOWER_DIR